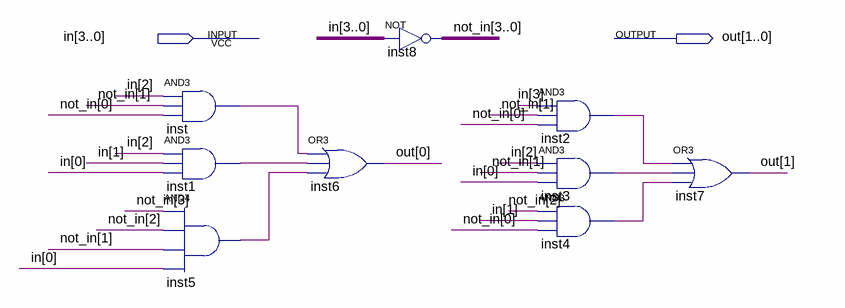
[diagram p0: schematic sheet]
// Quartus schematic mod3.bdf as structural Verilog: 9 symbols, 2 pins
module mod3 (
  input  [3:0] in,
  output [1:0] out
);

  wire inst1_out, inst2_out, inst3_out, inst4_out, inst5_out, inst_out;
  wire [3:0] not_in;

  and inst (inst_out, in[2], not_in[1], not_in[0]);
  and inst1 (inst1_out, in[2], in[1], in[0]);
  and inst5 (inst5_out, not_in[3], not_in[2], not_in[1], in[0]);
  or inst6 (out[0], inst_out, inst1_out, inst5_out);
  assign not_in = ~in;  // NOT inst8, 4 bits wide
  and inst2 (inst2_out, in[3], not_in[1], not_in[0]);
  and inst3 (inst3_out, in[2], not_in[1], in[0]);
  and inst4 (inst4_out, not_in[2], in[1], not_in[0]);
  or inst7 (out[1], inst2_out, inst3_out, inst4_out);
endmodule
